# EAGLE design aaasaver_v11 (EAGLE 6.1)
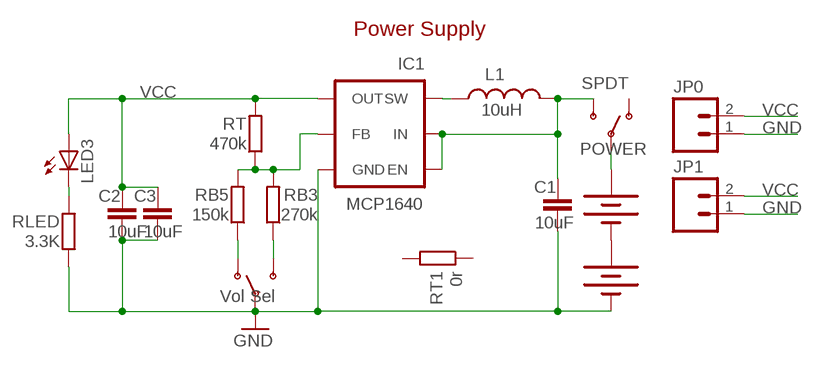
[diagram p0: schematic, sheet 1]

## Parts
AA1  BATTERYAAA  [BATTERY-AAA]
AA2  BATTERYAAA  [BATTERY-AAA]
C1  10uF  C-EUC0805  [C0805]
C2  10uF  C-EUC0805  [C0805]
C3  10uF  C-EUC0805  [C0805]
IC1  MCP1640  [TSOT23-6]
JP0  M021X02_NO_SILK  [1X02_NO_SILK]
JP1  M021X02_NO_SILK  [1X02_NO_SILK]
L1  10uH  INDUCTOR_SMDD45  [INDUCTOR_D45]
LED3  0805  LEDCHIPLED_1206  [CHIPLED_1206]
POWER  SPDT  SWITCH-SPSTSMD2  [SWITCH-SPDT-SMD]
RB3  270k  R-EU_R0805  [R0805]
RB5  150k  R-EU_R0805  [R0805]
RLED  3.3K  R-EU_R0805  [R0805]
RT  470k  R-EU_R0805  [R0805]
RT1  0r  R-EU_R1206  [R1206]
VOL1  Vol Sel  SWITCH-SPSTSMD2  [SWITCH-SPDT-SMD]

## Nets
GND: AA2.GND@1(-) C1.2 C2.2 C3.2 IC1.2(GND) JP0.1 JP1.1 RLED.1 VOL1.2(P)
N$1: IC1.4(FB) RB3.2 RB5.2 RT.1
N$2: RB5.1 VOL1.1(O)
N$3: RB3.1 VOL1.3(S)
N$6: AA1.PWR@1(+) POWER.2(P)
N$8: LED3.C RLED.2
N$16: AA1.GND@1(-) AA2.PWR@1(+)
N$26 [power]: IC1.1(SW) L1.P$2
PWR [power]: C1.1 IC1.3(EN) IC1.6(IN) L1.P$1 POWER.3(S)
VCC: C2.1 C3.1 IC1.5(OUT) JP0.2 JP1.2 LED3.A RT.2
Unconnected: POWER.1(O) RT1.1 RT1.2

## Notes on the sheet
- Power Supply

## Library data of the parts
AA1 AA2 = SparkFun:BATTERY: Battery Holders Various common sizes : AA, AAA, 20mm coin cell and 12mm coin cell.
C1-C3 = resistor:C-EU: CAPACITOR, European symbol
IC1 = linear-technology:MCP1640
JP0 JP1 = SparkFun:M02: Header 2 Standard 2-pin 0.1" header. Use with straight break away headers (SKU : PRT-00116), right angle break away headers (PRT-00553), swiss pins (PRT-00743), machine pins (PRT-00117), and female headers (PRT-00115). Molex polarized connector foot print use with SKU : PRT-08233 with associated crimp pins and housings.
L1 = linear-technology:INDUCTOR_SMD
LED3 = led:LED: LED OSRAM: - CHIPLED LG R971, LG N971, LY N971, LG Q971, LY Q971, LO R971, LY R971 LH N974, LH R974 LS Q976, LO Q976, LY Q976 LO Q996 - Hyper CHIPLED LW Q18S LB Q993, LB Q99A, LB R99A - SideLED LS A670, LO A670, LY A670, LG A670, LP A670 LB A673, LV A673, LT A673, LW A673 LH A674 LY A675 LS A676, LA A676, LO A676, LY A676, LW A676 LS A679, LY A679, LG A679 - Hyper Micro SIDELED® LS Y876, LA Y876, LO Y876, LY Y876 LT Y87S - SmartLED LW L88C, LW L88S LB L89C, LB L89S, LG L890 LS L89K, LO L89K, LY L89K LS L896, LA L896, LO L896, LY L896 - TOPLED LS T670, LO T670, LY T670, LG T670, LP T670 LSG T670, LSP T670, LSY T670, LOP T670, LYG T670 LG T671, LOG T671, LSG T671 LB T673, LV T673, LT T673, LW T673 LH T674 LS T676, LA T676, LO T676, LY T676, LB T676, LH T676, LSB T676, LW T676 LB T67C, LV T67C, LT T67C, LS T67K, LO T67K, LY T67K, LW E67C LS E67B, LA E67B, LO E67B, LY E67B, LB E67C, LV E67C, LT E67C LW T67C LS T679, LY T679, LG T679 LS T770, LO T770, LY T770, LG T770, LP T770 LB T773, LV T773, LT T773, LW T773 LH T774 LS E675, LA E675, LY E675, LS T675 LS T776, LA T776, LO T776, LY T776, LB T776 LHGB T686 LT T68C, LB T68C - Hyper Mini TOPLED® LB M676 - Mini TOPLED Santana® LG M470 LS M47K, LO M47K, LY M47K Source: http://www.osram.convergy.de LUXEON: - LUMILED® LXK2-PW12-R00, LXK2-PW12-S00, LXK2-PW14-U00, LXK2-PW14-V00 LXK2-PM12-R00, LXK2-PM12-S00, LXK2-PM14-U00 LXK2-PE12-Q00, LXK2-PE12-R00, LXK2-PE12-S00, LXK2-PE14-T00, LXK2-PE14-U00 LXK2-PB12-K00, LXK2-PB12-L00, LXK2-PB12-M00, LXK2-PB14-N00, LXK2-PB14-P00, LXK2-PB14-Q00 LXK2-PR12-L00, LXK2-PR12-M00, LXK2-PR14-Q00, LXK2-PR14-R00 LXK2-PD12-Q00, LXK2-PD12-R00, LXK2-PD12-S00 LXK2-PH12-R00, LXK2-PH12-S00 LXK2-PL12-P00, LXK2-PL12-Q00, LXK2-PL12-R00 Source: www.luxeon.com KINGBRIGHT: KA-3528ASYC Source: www.kingbright.com
POWER VOL1 = SparkFun:SWITCH-SPST: SPST Switch Simple slide switch. Spark Fun Electronics SKU : COM-00102
RB3 RB5 RLED RT RT1 = rcl:R-EU_: RESISTOR, European symbol

## Net classes
0 default: width 0.406 mm, clearance 0.203 mm
1 power: width 0.406 mm, clearance 0.203 mm

## Board
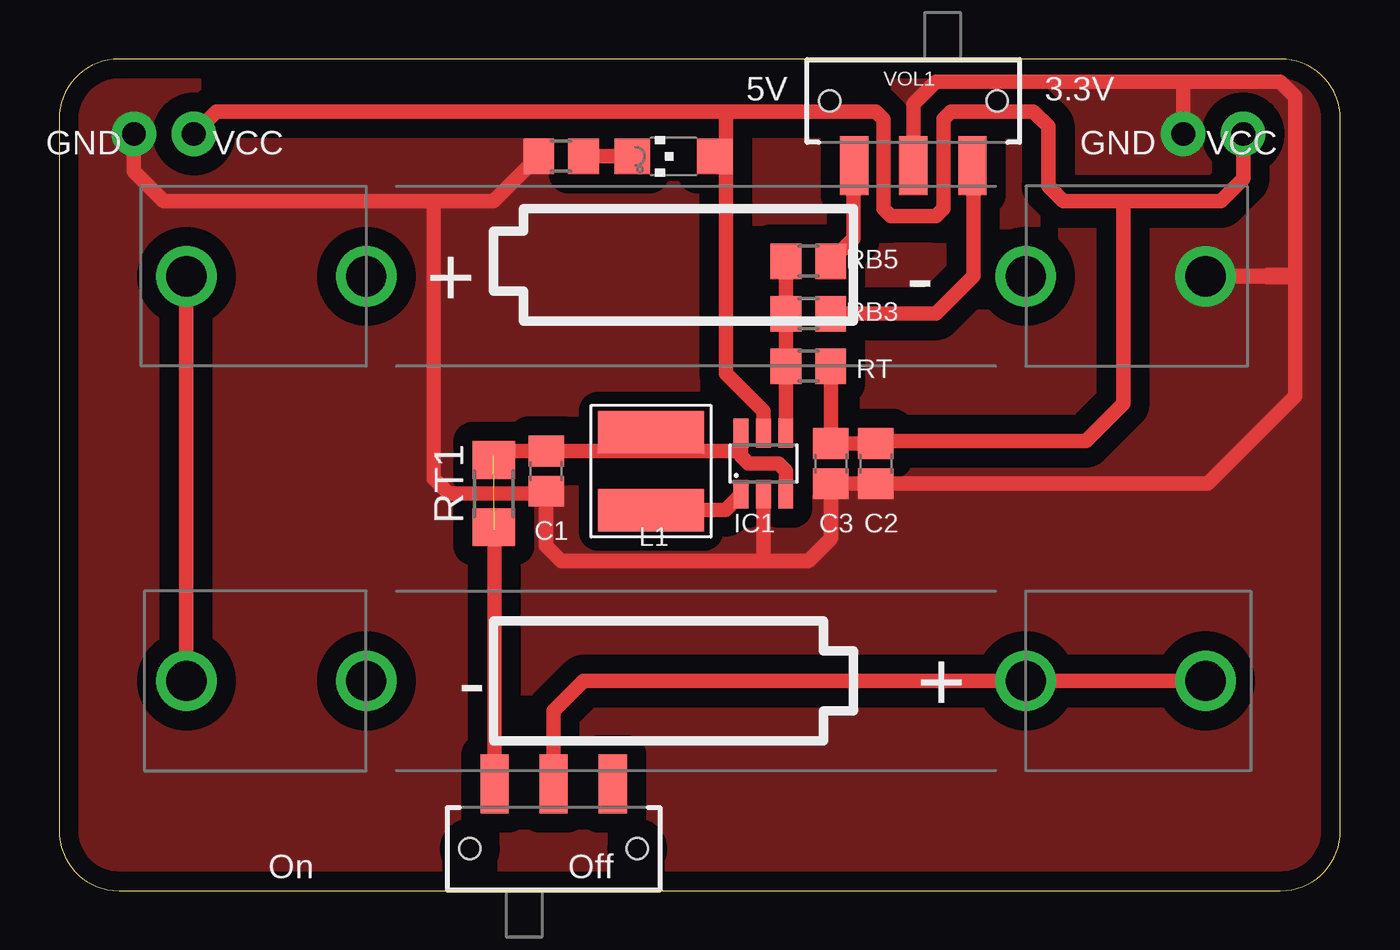
[diagram p1: board, top side]

Size 54.29 x 35.24 mm. Coordinates in mm from the lower left corner, seen from the top.
Outline: 2.54,0 51.75,0 arc90 54.29,2.54 54.29,32.7 arc90 51.75,35.24 2.54,35.24 arc90 0,32.7 0,2.54 arc90 2.54,0
Copper layers (1*16): Top 0.035mm / dielectric 1.5mm / Bottom 0.035mm
Design rules: minimum track width 6mil, minimum drill 12mil, track to track 6mil, track to pad 6mil, pad to pad 6mil, via to via 6mil, smd to smd 0mil, copper to edge 10mil, drill to drill 10mil, minimum pad ring 10mil, minimum via ring 6mil, stop-mask expansion 2mil, vias tented up to drill 100mil, thermal gap 20mil

### Footprints (pad centres in the part's own frame; a part is rotated, then mirrored left to right if it is on the bottom)
BATTERY-AAA = drill 1.702: GND@1 21.59,0; GND@2 13.97,0; PWR@1 -21.59,0; PWR@2 -13.97,0
C0805 = smd 1.3 x 1.5: 1 -0.85,0; 2 0.85,0
TSOT23-6 = smd 0.62 x 1.22: 1 -0.95,-1.3; 2 0,-1.3; 3 0.95,-1.3; 4 0.95,1.3; 5 0,1.3; 6 -0.95,1.3
1X02_NO_SILK = drill 1.016 pad 1.88: 1 0,0; 2 2.54,0
INDUCTOR_D45 = smd 1.8 x 4.5: P$1 -1.65,0; P$2 1.65,0
CHIPLED_1206 = smd 1.5 x 1.5: A 0,-1.75; C 0,1.75
SWITCH-SPDT-SMD = smd 1.2 x 2.5: 1 -2.5,-2.75; 2 0,-2.75; 3 2.5,-2.75 | hole 0.9: -3.55,0; 3.55,0
R0805 = smd 1.3 x 1.5: 1 -0.95,0; 2 0.95,0
R1206 = smd 1.6 x 1.803: 1 -1.422,0; 2 1.422,0

### Placement (x,y rotation side)
AA1  26.99,8.89 180 top
AA2  26.99,26.04 0 top
C1  20.64,17.78 270 top
C2  34.61,18.1 270 top
C3  32.7,18.1 270 top
IC1  29.84,18.1 0 top
JP0  47.62,32.07 0 top
JP1  3.17,32.07 0 top
L1  25.08,17.78 270 top
LED3  26.04,31.11 90 top
POWER  20.95,1.78 180 top
RB3  31.75,24.45 180 top
RB5  31.75,26.67 180 top
RLED  21.27,31.11 0 top
RT  31.75,22.23 0 top
RT1  18.41,16.83 90 top
VOL1  36.2,33.46 0 top

### Tracks (layer width: path | path; a pad name or v marks a point on that pad's centre or on a via)
GND
  Top 0.61: 20.64,16.83 C1.2 20.54,16.83 | 20.64,16.83 20.64,14.61 21.27,13.97 29.84,13.97 | 29.84,13.97 31.75,13.97 32.7,14.92 C3.2 C2.2 48.68,17.25 52.39,20.95 52.39,25.97 AA2.GND@1 52.39,26.1 52.39,33.66 51.75,34.29 47.62,34.29 | 29.84,13.97 IC1.2 | VOL1.2 36.2,33.34 37.15,34.29 47.62,34.29 | JP0.1 47.62,34.29 | JP1.1 3.17,30.48 4.45,29.21 15.88,29.21 | 15.88,29.21 18.41,29.21 RLED.1 | 15.88,29.21 15.88,17.46 16.51,16.83 20.64,16.83
  pour Top (isolate 0.813, no thermals): 0.32,0.32 54.61,0.32 54.61,34.92 0.32,34.92
N$1  (1 unrouted)
  Top 0.61: IC1.4 30.8,21.27 RB3.2 RT.1 | RB5.2 RT.1
N$2
  Top 0.61: RB5.1 33.66,27.62 33.66,30.67 VOL1.1
N$3
  Top 0.61: RB3.1 37.15,24.45 38.73,26.04 38.73,30.67 VOL1.3
N$6
  Top 0.61: POWER.2 20.95,7.62 22.23,8.89 AA1.PWR@1
N$8
  Top 0.61: LED3.C RLED.2
N$16
  Top 0.61: AA1.GND@1 AA2.PWR@1
N$26
  Top 0.61: L1.P$2 28.23,16.13 IC1.1
PWR  (1 unrouted)
  Top 0.61: IC1.6 28.89,18.52 | IC1.3 30.8,17.78 30.48,18.1 29.21,18.1 28.89,18.41 28.89,18.52 | 24.7,18.63 C1.1 18.63,18.63 18.41,18.41 | 28.79,18.63 28.89,18.73 | 28.79,18.63 24.7,18.63 | 24.7,18.63 L1.P$1 | 28.89,18.52 28.79,18.63 | POWER.3 18.45,15.28 18.41,15.24
VCC
  Top 0.61: RT.2 C3.1 C2.1 34.71,19.05 43.5,19.05 45.09,20.64 45.09,29.21 | 28.26,33.02 34.61,33.02 34.92,32.7 34.92,28.89 35.24,28.57 37.15,28.57 37.47,28.89 37.47,32.7 37.78,33.02 41.27,33.02 41.91,32.38 41.91,29.84 42.55,29.21 45.09,29.21 | 28.26,33.02 6.67,33.02 JP1.2 | IC1.5 29.84,20.32 28.26,21.91 28.26,31.11 | 28.26,31.11 28.26,33.02 | LED3.A 28.26,31.11 | 45.09,29.21 49.21,29.21 50.16,30.16 JP0.2

### Text on the board
tNames: 5V | 3.3V | GND | VCC | GND | VCC | On | Off